# Altium schematic sheet MCU.SchDoc: MCU
size A4; Date: 2016/01/06; Author: Samuel López; DocumentNumber: 7; SheetNumber: 7; SheetTotal: 7; Project: H2H Main Board
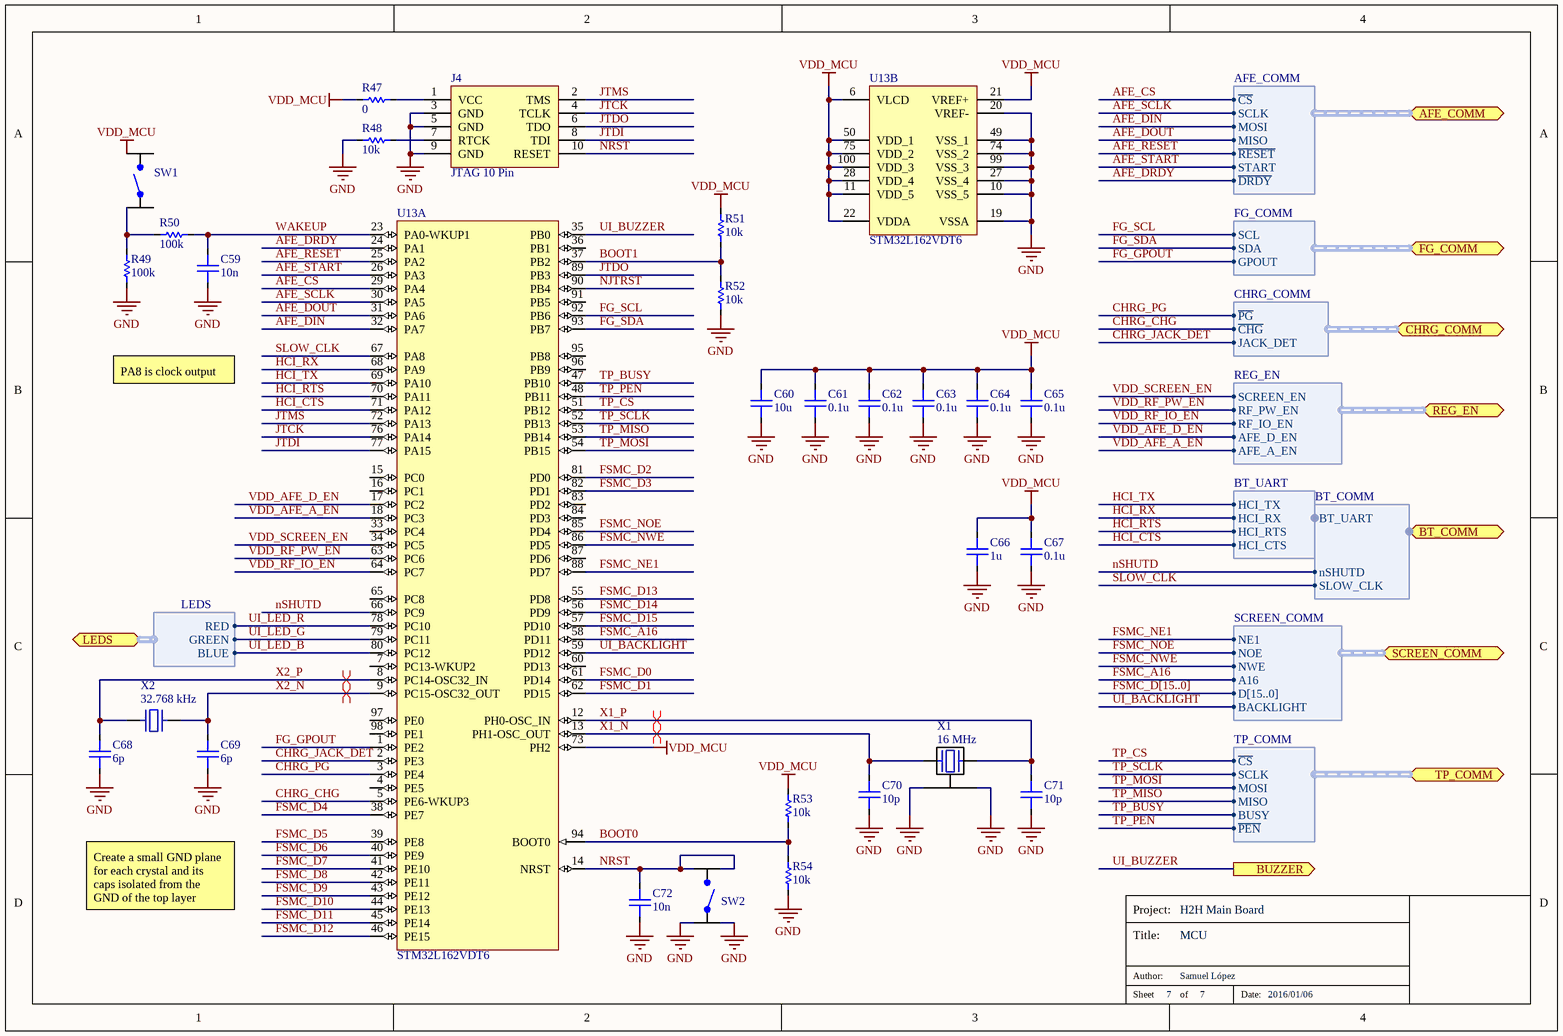
[diagram p0: MCU.SchDoc]

## Parts
C59  10n  [C0603]
C60  10u  [C0603]
C61  0.1u  [C0603]
C62  0.1u  [C0603]
C63  0.1u  [C0603]
C64  0.1u  [C0603]
C65  0.1u  [C0603]
C66  1u  [C0603]
C67  0.1u  [C0603]
C68  6p  [C0603]
C69  6p  [C0603]
C70  10p  [C0603]
C71  10p  [C0603]
C72  10n  [C0603]
J4  JTAG 10 Pin  [3220-10-0200-00]
R47  0  [R0603]
R48  10k  [R0603]
R49  100k  [R0603]
R50  100k  [R0603]
R51  10k  [R0603]
R52  10k  [R0603]
R53  10k  [R0603]
R54  10k  [R0603]
SW1  WS-TASU 436331045822  [WS-TASU 436331045822]  (value not drawn)
SW2  EVQ-Q2K01W  [EVQ-Q2K01W]  (value not drawn)
U13  STM32L162VDT6  [STM-LQFP100_N]  (parts A,B of 2)
X1  Frequency: 16 MHz  [ABM3B-16.000MHZ-10-1-U]  (hidden comment: ABM3B-16.000MHZ-10-1-U)
X2  Frequency: 32.768 kHz  [ABS07-120-32.768KHZ-T]  (hidden comment: ABS07-120-32.768KHZ-T)

## Ports
AFE_COMM (harness AFE_COMM), BT_COMM (harness BT_COMM), BUZZER (out), CHRG_COMM (harness CHRG_COMM), FG_COMM (harness FG_COMM), LEDS (harness LEDS), REG_EN (harness REG_EN), SCREEN_COMM (harness SCREEN_COMM), TP_COMM (harness TP_COMM)

## Harnesses
SCREEN_COMM: NE1, NOE, NWE, A16, D[15..0], BACKLIGHT
AFE_COMM: SCLK, MOSI, MISO, ~{CS}, ~{RESET}, START, ~{DRDY}
FG_COMM: SCL, SDA, GPOUT
CHRG_COMM: ~{PG}, ~{CHG}, JACK_DET
REG_EN: SCREEN_EN, RF_PW_EN, RF_IO_EN, AFE_D_EN, AFE_A_EN
BT_COMM: BT_UART, nSHUTD, SLOW_CLK
BT_UART: HCI_TX, HCI_RX, HCI_RTS, HCI_CTS
TP_COMM: ~{CS}, SCLK, MOSI, MISO, BUSY, ~{PEN}
LEDS: RED, GREEN, BLUE

## Nets
GND: C59.1 C60.1 C61.1 C62.1 C63.1 C64.1 C65.1 C66.1 C67.1 C68.1 C69.1 C70.1 C71.1 C72.1 J4.3(GND) J4.5(GND) J4.9(GND) R48.1 R49.1 R52.1 R54.1 SW2.1(A1) SW2.2(A2) U13.10(VSS_5) U13.19(VSSA) U13.20(VREF-) U13.27(VSS_4) U13.49(VSS_1) U13.74(VSS_2) U13.99(VSS_3) X1.2 X1.4
VDD_MCU: C60.2 C61.2 C62.2 C63.2 C64.2 C65.2 C66.2 C67.2 R47.1 R51.2 R53.2 SW1.2 U13.6(VLCD) U13.11(VDD_5) U13.21(VREF+) U13.22(VDDA) U13.28(VDD_4) U13.50(VDD_1) U13.73(PH2) U13.75(VDD_2) U13.100(VDD_3)
AFE_CS: U13.29(PA4) ; port AFE_COMM.~{CS}
AFE_DIN: U13.32(PA7) ; port AFE_COMM.MOSI
AFE_DOUT: U13.31(PA6) ; port AFE_COMM.MISO
AFE_DRDY: U13.24(PA1) ; port AFE_COMM.~{DRDY}
AFE_RESET: U13.25(PA2) ; port AFE_COMM.~{RESET}
AFE_SCLK: U13.30(PA5) ; port AFE_COMM.SCLK
AFE_START: U13.26(PA3) ; port AFE_COMM.START
BOOT0: R53.1 R54.2 U13.94(BOOT0)
BOOT1: R51.1 R52.2 U13.37(PB2)
CHRG_CHG: U13.5(PE6-WKUP3) ; port CHRG_COMM.~{CHG}
CHRG_JACK_DET: U13.2(PE3) ; port CHRG_COMM.JACK_DET
CHRG_PG: U13.3(PE4) ; port CHRG_COMM.~{PG}
FG_GPOUT: U13.1(PE2) ; port FG_COMM.GPOUT
FG_SCL: U13.92(PB6) ; port FG_COMM.SCL
FG_SDA: U13.93(PB7) ; port FG_COMM.SDA
FSMC_A16: U13.58(PD11) ; port SCREEN_COMM.A16
FSMC_D0: U13.61(PD14)
FSMC_D1: U13.62(PD15)
FSMC_D2: U13.81(PD0)
FSMC_D3: U13.82(PD1)
FSMC_D4: U13.38(PE7)
FSMC_D5: U13.39(PE8)
FSMC_D6: U13.40(PE9)
FSMC_D7: U13.41(PE10)
FSMC_D8: U13.42(PE11)
FSMC_D9: U13.43(PE12)
FSMC_D10: U13.44(PE13)
FSMC_D11: U13.45(PE14)
FSMC_D12: U13.46(PE15)
FSMC_D13: U13.55(PD8)
FSMC_D14: U13.56(PD9)
FSMC_D15: U13.57(PD10)
FSMC_NE1: U13.88(PD7) ; port SCREEN_COMM.NE1
FSMC_NOE: U13.85(PD4) ; port SCREEN_COMM.NOE
FSMC_NWE: U13.86(PD5) ; port SCREEN_COMM.NWE
HCI_CTS: U13.71(PA12) ; harness BT_UART.HCI_CTS
HCI_RTS: U13.70(PA11) ; harness BT_UART.HCI_RTS
HCI_RX: U13.68(PA9) ; harness BT_UART.HCI_RX
HCI_TX: U13.69(PA10) ; harness BT_UART.HCI_TX
JTCK: J4.4(TCLK) U13.76(PA14)
JTDI: J4.8(TDI) U13.77(PA15)
JTDO: J4.6(TDO) U13.89(PB3)
JTMS: J4.2(TMS) U13.72(PA13)
NJTRST: U13.90(PB4)
NRST: C72.2 J4.10(RESET) SW2.3(B2) SW2.4(B1) U13.14(NRST)
nSHUTD: U13.66(PC9) ; port BT_COMM.nSHUTD
SLOW_CLK: U13.67(PA8) ; port BT_COMM.SLOW_CLK
TP_BUSY: U13.47(PB10) ; port TP_COMM.BUSY
TP_CS: U13.51(PB12) ; port TP_COMM.~{CS}
TP_MISO: U13.53(PB14) ; port TP_COMM.MISO
TP_MOSI: U13.54(PB15) ; port TP_COMM.MOSI
TP_PEN: U13.48(PB11) ; port TP_COMM.~{PEN}
TP_SCLK: U13.52(PB13) ; port TP_COMM.SCLK
UI_BACKLIGHT: U13.59(PD12) ; port SCREEN_COMM.BACKLIGHT
UI_BUZZER: U13.35(PB0) ; port BUZZER
UI_LED_B: U13.80(PC12) ; port LEDS.BLUE
UI_LED_G: U13.79(PC11) ; port LEDS.GREEN
UI_LED_R: U13.78(PC10) ; port LEDS.RED
VDD_AFE_A_EN: U13.18(PC3) ; port REG_EN.AFE_A_EN
VDD_AFE_D_EN: U13.17(PC2) ; port REG_EN.AFE_D_EN
VDD_RF_IO_EN: U13.64(PC7) ; port REG_EN.RF_IO_EN
VDD_RF_PW_EN: U13.63(PC6) ; port REG_EN.RF_PW_EN
VDD_SCREEN_EN: U13.34(PC5) ; port REG_EN.SCREEN_EN
WAKEUP: C59.2 R50.2 U13.23(PA0-WKUP1)
X1_N: C70.2 U13.13(PH1-OSC_OUT) X1.1
X1_P: C71.2 U13.12(PH0-OSC_IN) X1.3
X2_N: C69.2 U13.9(PC15-OSC32_OUT) X2.1
X2_P: C68.2 U13.8(PC14-OSC32_IN) X2.2
NetJ4_1: J4.1(VCC) R47.2
NetJ4_7: J4.7(RTCK) R48.2
NetR49_2: R49.2 R50.1 SW1.1

Not connected (* = marked no-connect by the designer): SW1 3 4; U13 4(PE5) 7(PC13-WKUP2) 15(PC0) 16(PC1) 33(PC4) 36(PB1) 60(PD13) 65(PC8) 83(PD2) 84(PD3) 87(PD6) 91(PB5) 95(PB8) 96(PB9) 97(PE0) 98(PE1)

## Buses and harness runs
bus FSMC_D[15..0]

## Layout directives
differential pair: X1_N, X1_P, X2_N, X2_P

## Notes on the sheet
- PA8 is clock output
- Create a small GND plane
  for each crystal and its
  caps isolated from the
  GND of the top layer
- Project:
- Title:
- Sheet
- Author:
- of
- Date:

## Library data of the parts
C59-C72 = Capacitor: Rated Voltage: *
  C59 C72: Value: 10n
  C60: Value: 10u
  C61-C65 C67: Value: 0.1u
  C66: Value: 1u
  C68 C69: Value: 6p
  C70 C71: Value: 10p
J4 = 3220-10-0200-00: Conn - JTAG, Header, Male, Right Angle, 10 Pin, 1.27mm Pitch, ARM Standard; Supplier 1: Digi-Key; Supplier Part Number 1: 1175-1628-ND
R47-R54 = Resistor: Power: *
  R47: Value: 0
  R48 R51-R54: Value: 10k
  R49 R50: Value: 100k
SW1 = WS-TASU 436331045822: Switch - Tactile, Off-Mom, SPST, Side-Actuated; Supplier 1: Digi-Key; Supplier Part Number 1: 732-7059-1-ND
SW2 = EVQ-Q2K01W: Switch - Tactile, Off-Mom, SPST; Supplier 1: Digi-Key; Supplier Part Number 1: P12941SCT-ND
U13 = STM32L162VDT6: ARM Cortex-M3 32-bit MCU, 384 KB Flash, 48 KB Internal RAM, 83 I/Os, 100-pin LQFP, -40 to 85 degC, Tray; Manufacturer: STMicroelectronics; D/A Converter: 2x12-bit (2 Channel); Data E2PROM nom (B): 12288; Display controller: LCD 4x44/8x40; FLASH Size (Prog) (kB): 384; I/Os (High Current): 83; Integrated op-amps: 3; Internal RAM Size (kB): 48; Operating Frequency(F) (Processor speed) (MHz): 32; Supply Voltage(Vcc) min (V): 1.65; DatasheetVersion: Rev. 4; PackageVersion: Rev. 1, 06/2013; PackageReference: LQFP100; PackageDescription: 100-Pin Low Profile Quad Flat Package, 14 x 14 mm Body, 0.5 mm Pitch; Core: ARM Cortex-M3; Packing: Tray; Mounting Technology: Surface Mount; PartNumber: STM32L162VDT6; ComponentLink1Description: Manufacturer URL; ComponentLink1URL: http://www.st.com/web/en/home.html; ComponentLink2Description: Datasheet; ComponentLink2URL: http://www.st.com/st-web-ui/static/active/en/resource/technical/document/datasheet/DM00039232.pdf; ComponentLink3Description: Package Specification; ComponentLink3URL: http://www.st.com/st-web-ui/static/active/en/resource/technical/document/data_brief/DM00071938.pdf; Supplier 1: Farnell; Supplier Part Number 1: 2333341; Supplier 2: Mouser; Supplier Part Number 2: 511-STM32L162VDT6
X1 = ABM3B-16.000MHZ-10-1-U: Crystal - 16 MHz; Load Capacitance: 10 pF; ESR: 50 m; Supplier 1: Digi-Key; Supplier Part Number 1: 300-8206-1-ND
X2 = ABS07-120-32.768KHZ-T: Crystal - 32.768 kHz; Load Capacitance: 6 pF; Supplier 1: Digi-Key; Supplier Part Number 1: 535-11937-1-ND